# Altium project MiniPciExpressCard.PrjPCB
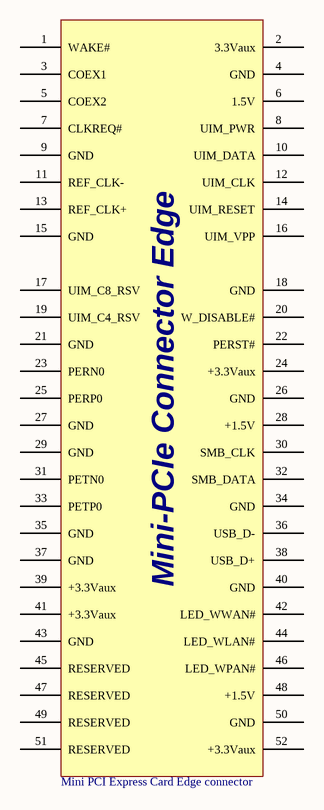
[diagram p0: MiniPCIe.SchDoc]
1 sheet, 1 parts. Net scope: global (net labels, ports and power ports of the same name join across sheets).
Board file: MiniPCIe.PcbDoc

## Sheet MiniPCIe.SchDoc
size A

### Parts
CN1  Mini PCI Express Card Edge connector  [Mini PCI Express]  (no BOM)

### Nets

Not connected (* = marked no-connect by the designer): CN1 1(WAKE#) 2(3.3Vaux) 3(COEX1) 4(GND) 5(COEX2) 6(1.5V) 7(CLKREQ#) 8(UIM_PWR) 9(GND) 10(UIM_DATA) 11(REF_CLK-) 12(UIM_CLK) 13(REF_CLK+) 14(UIM_RESET) 15(GND) 16(UIM_VPP) 17(UIM_C8_RSV) 18(GND) 19(UIM_C4_RSV) 20(W_DISABLE#) 21(GND) 22(PERST#) 23(PERN0) 24(+3.3Vaux) 25(PERP0) 26(GND) 27(GND) 28(+1.5V) 29(GND) 30(SMB_CLK) 31(PETN0) 32(SMB_DATA) 33(PETP0) 34(GND) 35(GND) 36(USB_D-) 37(GND) 38(USB_D+) 39(+3.3Vaux) 40(GND) 41(+3.3Vaux) 42(LED_WWAN#) 43(GND) 44(LED_WLAN#) 45(RESERVED) 46(LED_WPAN#) 47(RESERVED) 48(+1.5V) 49(RESERVED) 50(GND) 51(RESERVED) 52(+3.3Vaux)

### Notes on the sheet
- (in symbol MiniPCIe Card) Mini-PCIe Connector Edge

### Library data of the parts
CN1 = MiniPCIe Card